# EAGLE design board rev 1 (EAGLE 9.0.1)
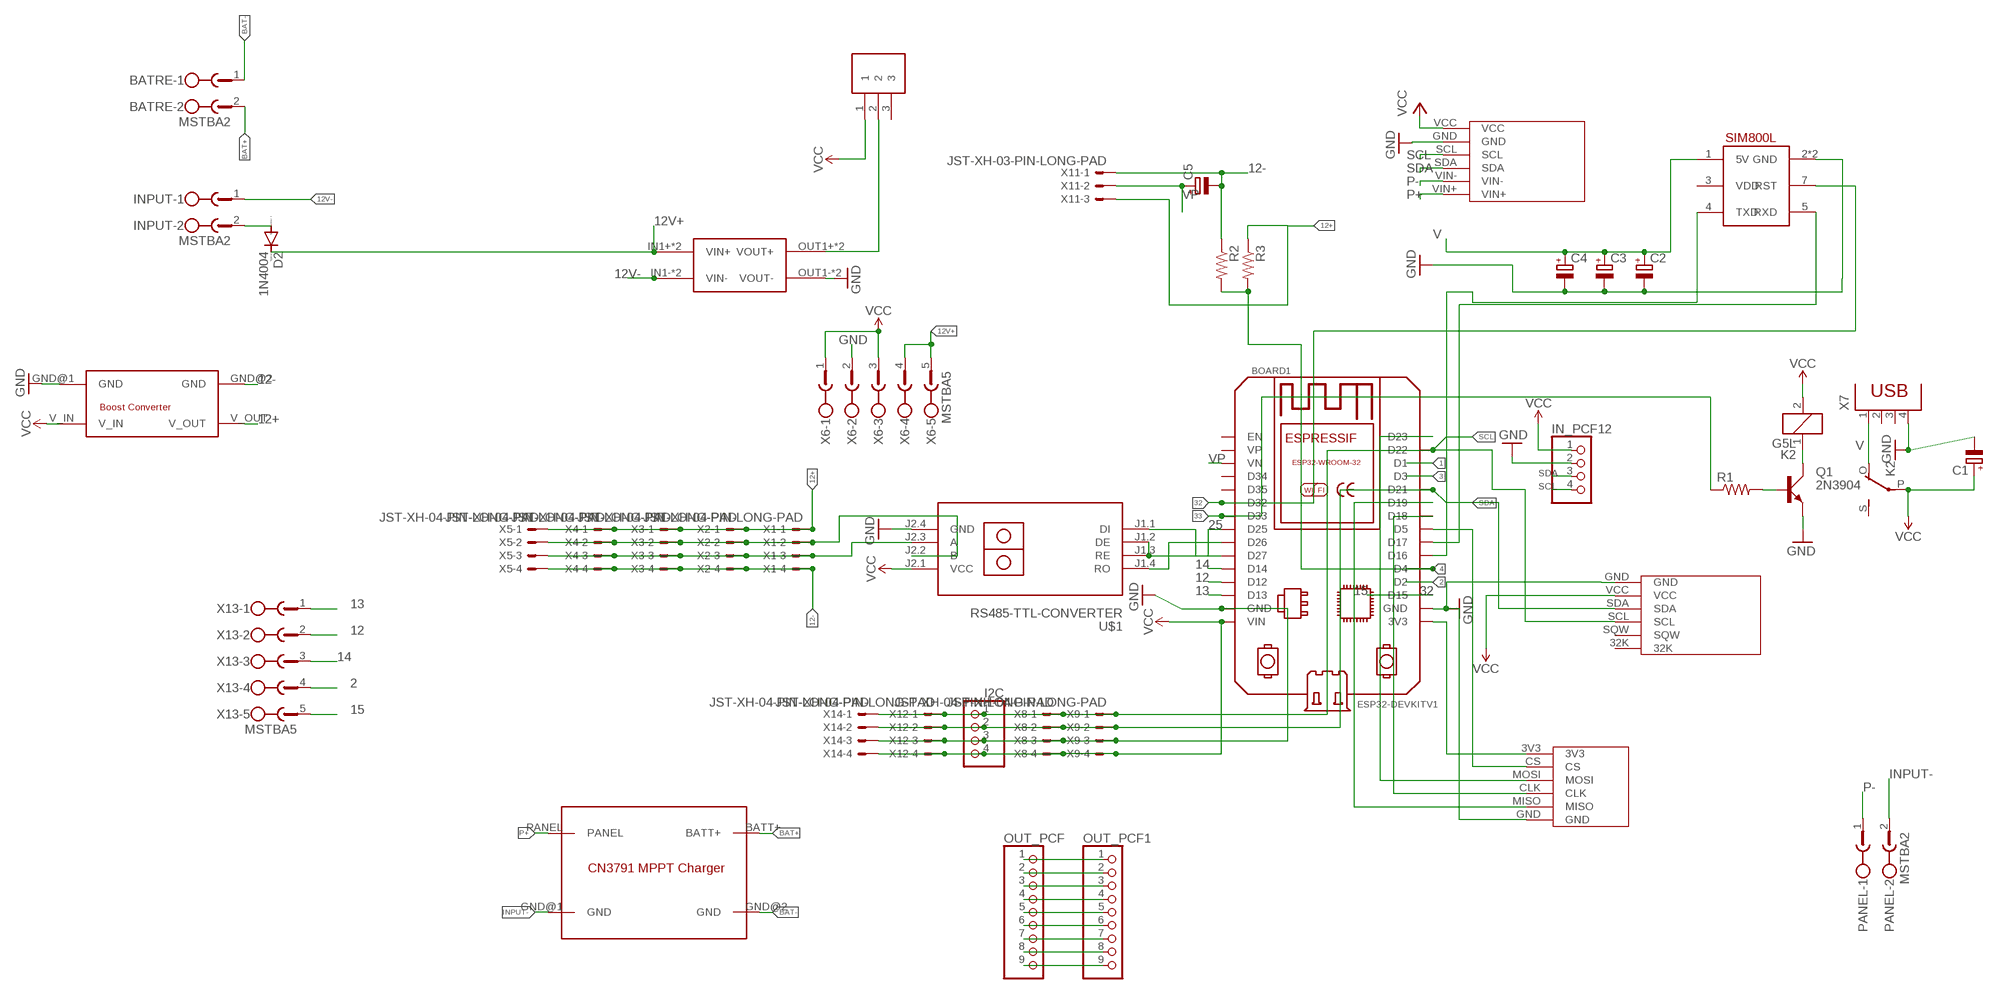
[diagram p0: schematic, sheet 1]

## Parts
BATRE  MSTBA2  [MSTBA2]
BOARD1  ESP32DEVKITV1  [ESP32-DEVKITV1]
C1  CPOL-EUE2.5-7  [E2,5-7]
C2  CPOL-EUE2.5-7  [E2,5-7]
C3  CPOL-EUE2.5-7  [E2,5-7]
C4  CPOL-EUE2.5-7  [E2,5-7]
C5  CPOL-EUE2.5-7  [E2,5-7]
D2  1N4004  [DO41-10]
I2C  PINHD-1X4  [1X04]
IN_PCF12  PINHD-1X4  [1X04]
INPUT  MSTBA2  [MSTBA2]
K2  G5L  [G5LE]
OUT_PCF  PINHD-1X9  [1X09]
OUT_PCF1  PINHD-1X9  [1X09]
PANEL  MSTBA2  [MSTBA2]
Q1  2N3904  [TO92D]
R1  R-US_0204/7  [0204/7]
R2  R-US_0204/7  [0204/7]
R3  R-US_0204/7  [0204/7]
SW1  SS12D10  [SS12D10]
U$1  RS485-TTL-CONVERTER  [RS485-TTL-CONVERTER]
U$2  CN3791_MTTP_LIPO_SOLAR_CHARGER  [CN3791_MPPT_LIPO_SOLAR_CHARGER]
U$3  MP1584  [DC-BRICK]
U$4  SIM800L  [SIP]
U$5  ICSA004A_BOOST_MODULE  [ICSA004A_BOOST_MODULE]
U$6  DS3231  [DS3231]
U$7  MICROSD3V3  [MICROSD3V3]
U$8  INA219  [INA219]
X1  JST-XH-04-PIN-LONG-PAD  [JST-XH-04-PACKAGE-LONG-PAD]
X2  JST-XH-04-PIN-LONG-PAD  [JST-XH-04-PACKAGE-LONG-PAD]
X3  JST-XH-04-PIN-LONG-PAD  [JST-XH-04-PACKAGE-LONG-PAD]
X4  JST-XH-04-PIN-LONG-PAD  [JST-XH-04-PACKAGE-LONG-PAD]
X5  JST-XH-04-PIN-LONG-PAD  [JST-XH-04-PACKAGE-LONG-PAD]
X6  MSTBA5  [MSTBA5]
X7  PN87520  [PN87520]
X8  JST-XH-04-PIN-LONG-PAD  [JST-XH-04-PACKAGE-LONG-PAD]
X9  JST-XH-04-PIN-LONG-PAD  [JST-XH-04-PACKAGE-LONG-PAD]
X11  JST-XH-03-PIN-LONG-PAD  [JST-XH-03-PACKAGE-LONG-PAD]
X12  JST-XH-04-PIN-LONG-PAD  [JST-XH-04-PACKAGE-LONG-PAD]
X13  MSTBA5  [MSTBA5]
X14  JST-XH-04-PIN-LONG-PAD  [JST-XH-04-PACKAGE-LONG-PAD]

## Nets
1: BOARD1.D1
2: BOARD1.D2 X13.4
3: BOARD1.D3
4: BOARD1.D4 R2.2 R3.2
12: BOARD1.D12 X13.2
12+: R3.1 U$5.V_OUT X1.1 X2.1 X3.1 X4.1 X5.1 X11.3
12-: C5.- R2.1 U$5.GND@2(GND) X1.4 X2.4 X3.4 X4.4 X5.4 X11.1
12V+: D2.C U$3.IN1+(VIN+) U$3.IN2+(VIN+) X6.4 X6.5
12V-: INPUT.1 U$3.IN1-(VIN-) U$3.IN2-(VIN-)
13: BOARD1.D13 X13.1
14: BOARD1.D14 X13.3
15: BOARD1.D15 X13.5
18: BOARD1.D18 U$7.CLK
19: BOARD1.D19 U$7.MISO
25: BOARD1.D25 U$1.J1.2(DE) U$1.J1.3(RE)
32: BOARD1.D32 U$4.7(RST)
33: BOARD1.D33 R1.1
BAT+: BATRE.2 U$2.BATT+
BAT-: BATRE.1 U$2.GND@2(GND)
GND: BOARD1.GND BOARD1.GND@1(GND) C1.- C2.- C3.- C4.- I2C.3 IN_PCF12.2 Q1.E U$1.J2.4(GND) U$3.OUT1-(VOUT-) U$3.OUT2-(VOUT-) U$4.2(GND) U$4.6(GND) U$5.GND@1(GND) U$6.GND U$7.GND U$8.GND X6.2 X7.4 X8.3 X9.3 X12.3 X14.3
INPUT-: PANEL.2 U$2.GND@1(GND)
N$1: BOARD1.D27 U$1.J1.1(DI)
N$2: BOARD1.D26 U$1.J1.4(RO)
N$3: OUT_PCF1.1 OUT_PCF.1
N$4: OUT_PCF1.2 OUT_PCF.2
N$5: SW1.2 U$3.OUT1+(VOUT+) U$3.OUT2+(VOUT+)
N$6: U$1.J2.2(B) X1.2 X2.2 X3.2 X4.2 X5.2
N$7: U$1.J2.3(A) X1.3 X2.3 X3.3 X4.3 X5.3
N$8: BOARD1.3V3 U$7.3V3
N$9: BOARD1.D5 U$7.CS
N$10: BOARD1.D23 U$7.MOSI
N$11: D2.A INPUT.2
N$12: OUT_PCF1.3 OUT_PCF.3
N$13: BOARD1.D16 U$4.4(TXD)
N$14: BOARD1.D17 U$4.5(RXD)
N$15: K2.1 Q1.C
N$16: OUT_PCF1.4 OUT_PCF.4
N$17: Q1.B R1.2
N$18: OUT_PCF1.5 OUT_PCF.5
N$20: OUT_PCF1.6 OUT_PCF.6
N$21: OUT_PCF1.7 OUT_PCF.7
N$22: OUT_PCF1.8 OUT_PCF.8
N$23: OUT_PCF1.9 OUT_PCF.9
P+: U$2.PANEL U$8.VIN+
P-: PANEL.1 U$8.VIN-
SCL: BOARD1.D22 I2C.1 IN_PCF12.4 U$6.SCL U$8.SCL X8.1 X9.1 X12.1 X14.1
SDA: BOARD1.D21 I2C.2 IN_PCF12.3 U$6.SDA U$8.SDA X8.2 X9.2 X12.2 X14.2
V: C2.+ C3.+ C4.+ K2.O(2:O) U$4.1(5V) X7.1
VCC: BOARD1.VIN C1.+ I2C.4 IN_PCF12.1 K2.2 K2.P(2:P) SW1.1 U$1.J2.1(VCC) U$5.V_IN U$6.VCC U$8.VCC X6.1 X6.3 X8.4 X9.4 X12.4 X14.4
VP: BOARD1.VN C5.+ X11.2
Unconnected: BOARD1.D34 BOARD1.D35 BOARD1.EN BOARD1.VP K2.S(2:S) SW1.3 U$4.3(VDD) U$6.32K U$6.SQW X7.2 X7.3

## Library data of the parts
BATRE INPUT PANEL = con-phoenix-508:MSTBA2: PHOENIX; MF: FARNELL; MPN: 1757242; OC_FARNELL: 3705171; OC_NEWARK: 71C4161
BOARD1 = ESP32-DEVKITV1:ESP32DEVKITV1: https://github.com/shridattdudhat
C1-C5 = FansElectronics-RCL:CPOL-EU: POLARIZED CAPACITOR, European symbol
D2 = diode:1N4004: DIODE general purpose rectifier, 1 A
I2C = FansElectronics-Header:PINHD-1X4: PIN HEADER
IN_PCF12 = pinhead:PINHD-1X4: PIN HEADER
K2 = relay:G5L: RELAY 1 x switch, 10 A/120 V AC, 8 A/30 V ADC, Omron; OC_FARNELL: unknown; OC_NEWARK: unknown
OUT_PCF OUT_PCF1 = FansElectronics-Header:PINHD-1X9: PIN HEADER
Q1 = transistor-small-signal:2N3904: NPN TRANSISTOR
R1-R3 = adafruit:R-US_: RESISTOR, American symbol
SW1 = ss12d10:SS12D10
U$1 = diy:RS485-TTL-CONVERTER: RS485 to TTL converter based on MAX485 chip
U$2 = mt3608:CN3791_MTTP_LIPO_SOLAR_CHARGER: CN3791 MPPT Solar charger module For single cell LIPO battery. Max 25V input.
U$3 = MP1584-dc-brick:MP1584: MP1584-dc-brick-pcb Step down Input: 4.5V - 28V Ouput 0.8V - 25V max. 3A Cheap on ebay
U$4 = SIM800L:SIM800L: SIM800L Blue EVB Board with Level Translation and diode dropper.
U$5 = mt3608:ICSA004A_BOOST_MODULE: ISCA004A Boost converter module Vin: 2-24 V Vout: 28 V Iout: 2 A (Realistic: 500mA without heatsink) Efficiency: 80% Low quiecent current (about 0.5mA) Not isolated (common ground) Dimensions: 36 mm * 17 mm * (8)14 mm http://www.icstation.com/icstation-mt3608-step-booster-power-apply-module-p-3448.html
U$6 = DS3231:DS3231
U$7 = microsd3v3:MICROSD3V3
U$8 = INA219:INA219
X1-X5 X8 X9 X12 X14 = Rembrandt Electronics - JST XH Connectors v1-0:JST-XH-04-PIN: JST XH Connector 2 Pin Wire to board connector. Pitch: 2,54 mm, (0.100") Number of pins: 4 Created by Rembrandt Electronics www.rembrandtelectronics.com
X6 X13 = con-phoenix-508:MSTBA5: PHOENIX; MPN: 1757271; OC_FARNELL: 3705201; OC_NEWARK: 71C4164
X7 = con-berg:PN87520: BERG USB connector; OC_FARNELL: unknown; OC_NEWARK: unknown
X11 = Rembrandt Electronics - JST XH Connectors v1-0:JST-XH-03-PIN: JST XH Connector 2 Pin Wire to board connector. Pitch: 2,54 mm, (0.100") Number of pins: 3 Created by Rembrandt Electronics www.rembrandtelectronics.com

## Board
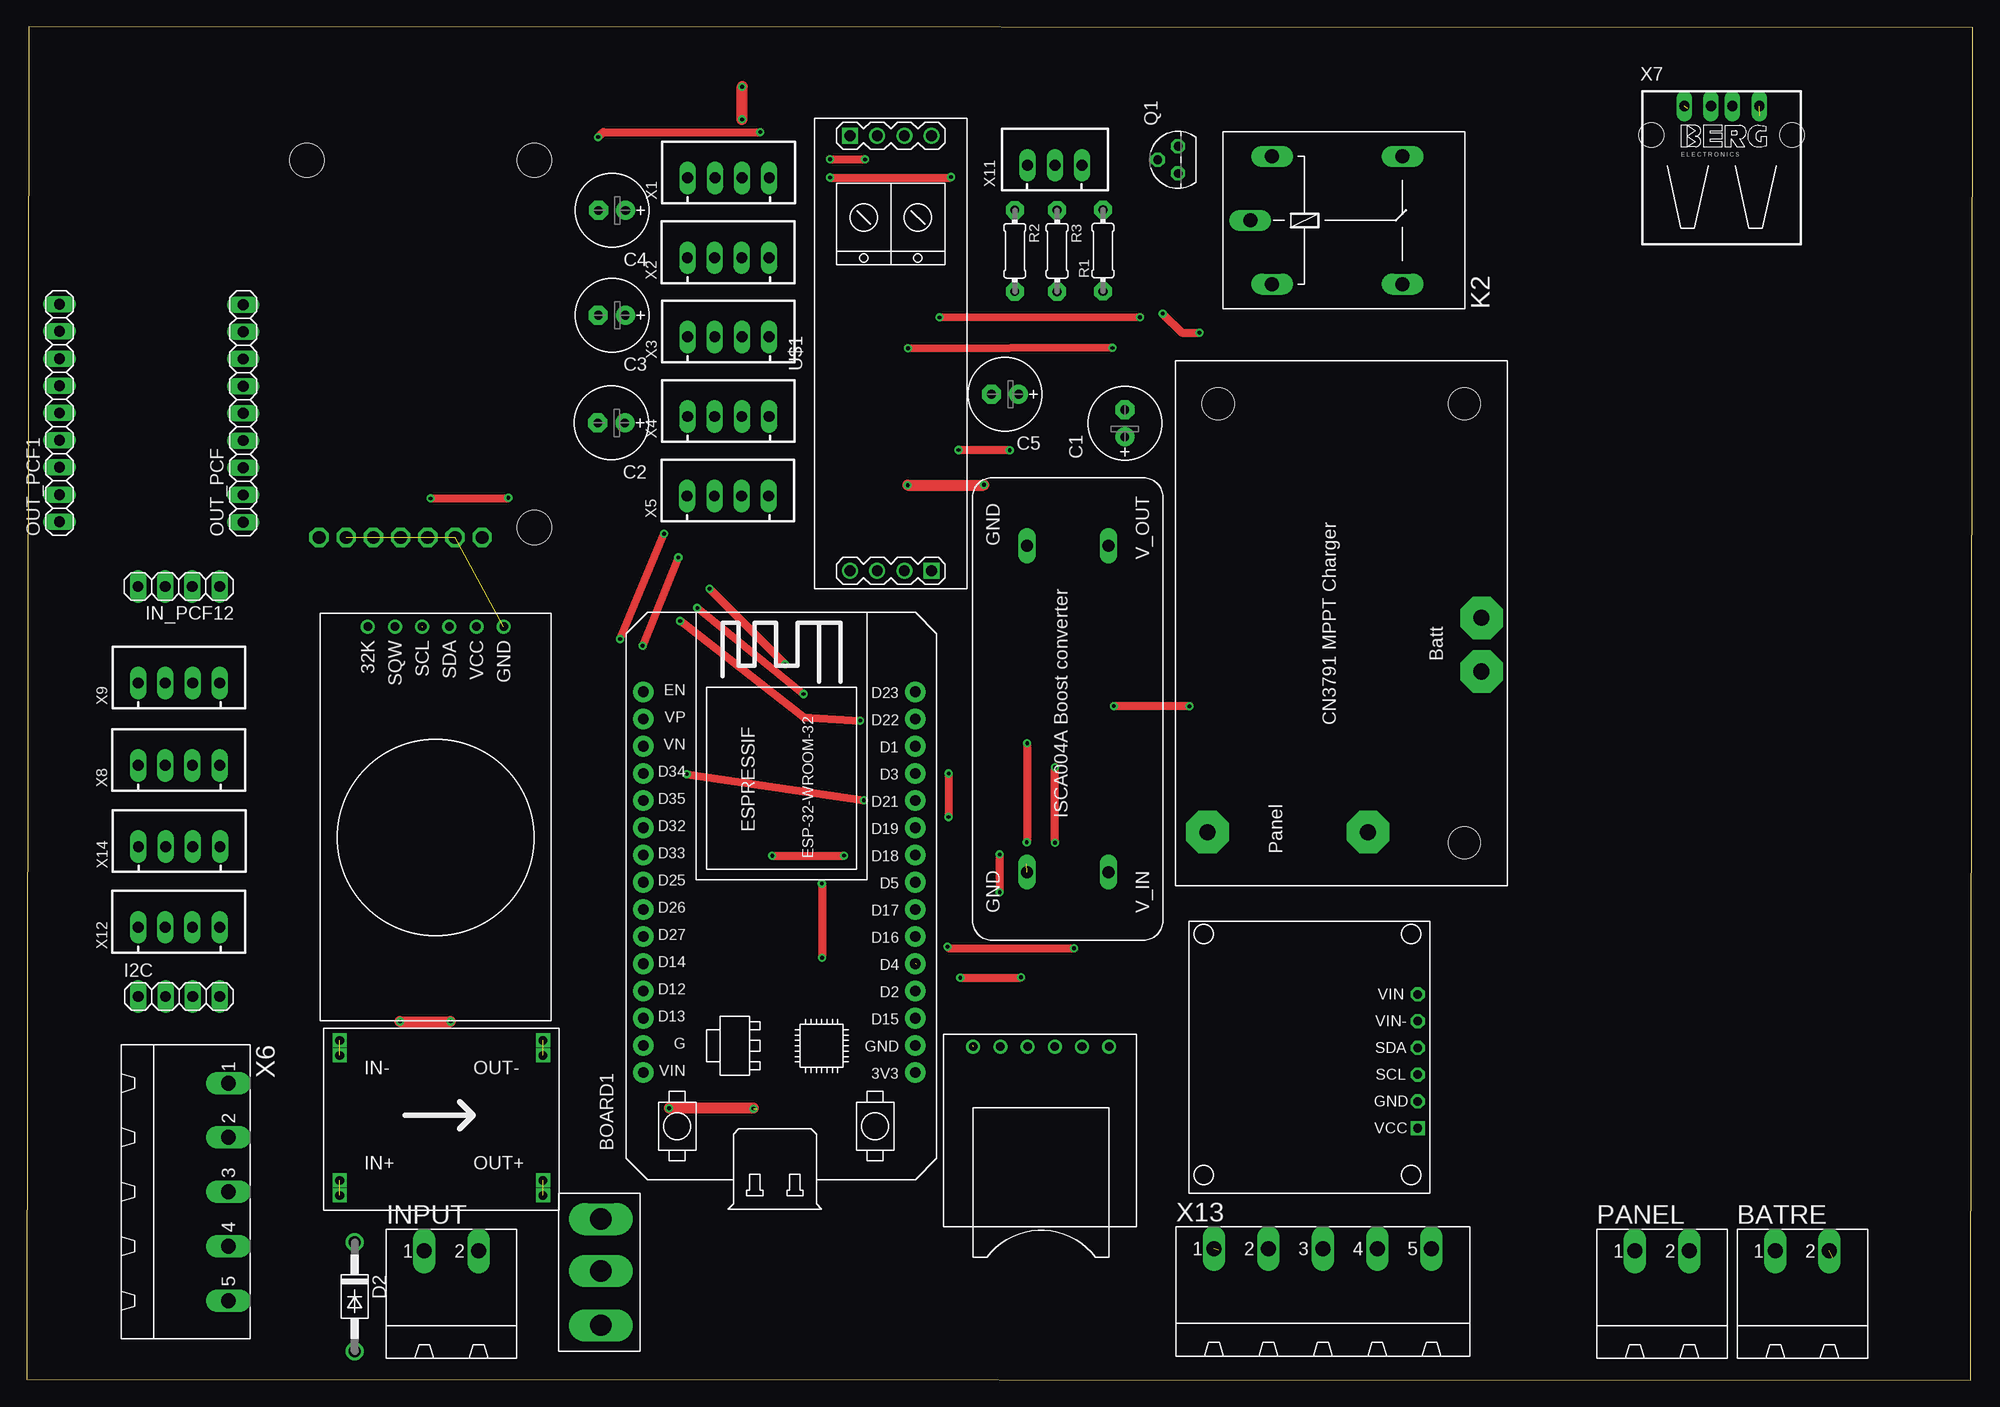
[diagram p1: board, top side]
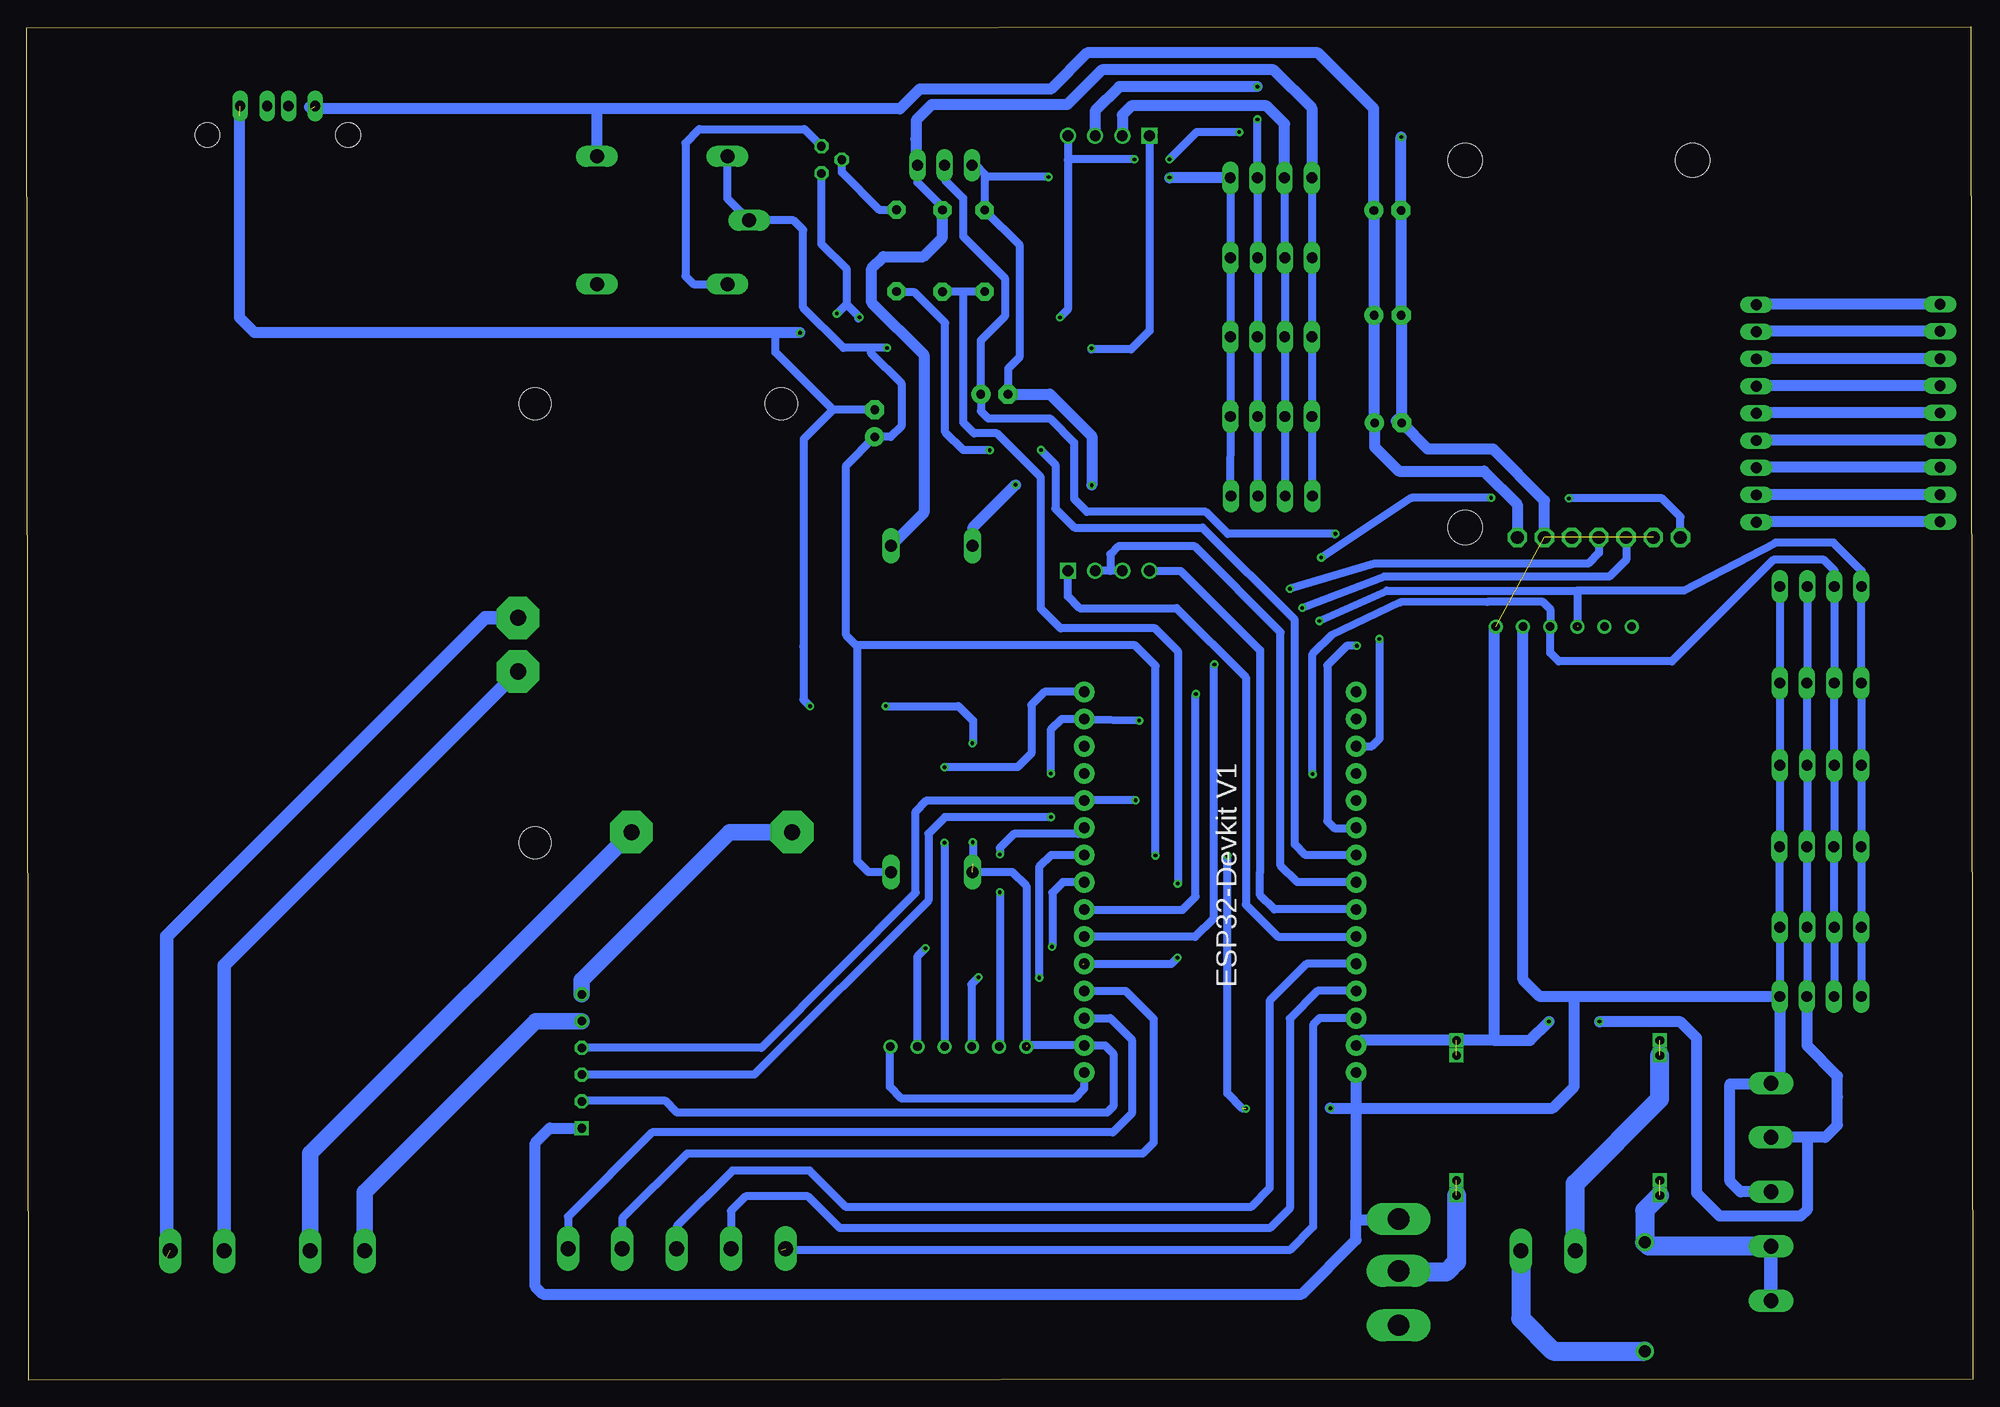
[diagram p2: board, bottom side, seen from below]

Size 181.8 x 126.41 mm. Coordinates in mm from the lower left corner, seen from the top.
Outline: 0,0.09 181.61,0 181.8,126.32 0.18,126.41 0,0.09
Copper layers (1*16): Top 0.035mm / dielectric 1.5mm / Bottom 0.035mm
Design rules "default": minimum track width 6mil, minimum drill 0.35mm, track to track 6mil, track to pad 6mil, pad to pad 6mil, via to via 6mil, smd to smd 6mil, copper to edge 40mil, drill to drill 6mil, minimum pad ring 10mil, minimum via ring 8mil, stop-mask expansion 4mil, vias tented up to drill 0mil, thermal gap 10mil

### Footprints (pad centres in the part's own frame; a part is rotated, then mirrored left to right if it is on the bottom)
MSTBA2 = drill 1.397 long: 1 -2.54,5.08; 2 2.54,5.08
ESP32-DEVKITV1 = drill 1 pad 1.93: 3V3 0,0; D1 30.48,0; D2 7.62,0; D3 27.94,0; D4 10.16,0; D5 17.78,0; D12 7.62,25.4; D13 5.08,25.4; D14 10.16,25.4; D15 5.08,0; D16 12.7,0; D17 15.24,0; D18 20.32,0; D19 22.86,0; D21 25.4,0; D22 33.02,0; D23 35.56,0; D25 17.78,25.4; D26 15.24,25.4; D27 12.7,25.4; D32 22.86,25.4; D33 20.32,25.4; D34 27.94,25.4; D35 25.4,25.4; EN 35.56,25.4; GND 2.54,25.4; GND@1 2.54,0; VIN 0,25.4; VN 30.48,25.4; VP 33.02,25.4
E2,5-7 = drill 0.813 pad 1.778: + -1.27,0 | drill 0.813 pad 1.778 octagon: - 1.27,0
DO41-10 = drill 1.118: A 5.08,0; C -5.08,0
1X04 = drill 1.016 long: 1 -3.81,0; 2 -1.27,0; 3 1.27,0; 4 3.81,0
G5LE = drill 1.321 long: 1 -7.493,-5.969; 2 -7.493,5.969; O 4.699,5.969; P -9.525,0; S 4.699,-5.969
1X09 = drill 1.016 long: 1 -10.16,0; 2 -7.62,0; 3 -5.08,0; 4 -2.54,0; 5 0,0; 6 2.54,0; 7 5.08,0; 8 7.62,0; 9 10.16,0
TO92D = drill 0.813 octagon: B 0,1.905; C 1.27,0; E -1.27,0
0204/7 = drill 0.813 pad 1.676 octagon: 1 -3.81,0; 2 3.81,0
SS12D10 = drill 2 pad 3 long: 1 0.127,4.699; 2 0.127,-0.127; 3 0.127,-5.207
RS485-TTL-CONVERTER = drill 1 square: J1.1 -20.32,-3.81; J2.1 20.32,3.81 | drill 1: J1.2 -20.32,-1.27; J1.3 -20.32,1.27; J1.4 -20.32,3.81; J2.2 20.32,1.27; J2.3 20.32,-1.27; J2.4 20.32,-3.81
CN3791_MPPT_LIPO_SOLAR_CHARGER = drill 1.5 pad 4 octagon: BATT+ 25,2.4; GND@1 5,13; GND@2 20,2.4; PANEL 5,28 | hole 3: 4,4; 45,4; 45,27
DC-BRICK = drill 0.8 square: IN1+ 1.5,1.4; IN1- 1.5,14.47; IN2+ 1.5,2.8; IN2- 1.5,15.87; OUT1+ 20.5,1.4; OUT1- 20.5,14.47; OUT2+ 20.5,2.8; OUT2- 20.5,15.87
SIP = drill 1.2 octagon: 1 38.1,19.24; 2 38.1,16.7; 3 38.1,14.16; 4 38.1,11.62; 5 38.1,9.08; 6 38.1,6.54; 7 38.1,4 | hole 3.2: 2.87,24.13; 2.87,2.87; 37.16,24.13
ICSA004A_BOOST_MODULE = drill 1.1 long: GND@1 0,7.62; GND@2 30.48,7.62; V_IN 0,0; V_OUT 30.48,0
DS3231 = drill 0.8: 32K 1.27,-17.145; GND 1.27,-4.445; SCL 1.27,-12.065; SDA 1.27,-9.525; SQW 1.27,-14.605; VCC 1.27,-6.985
MICROSD3V3 = drill 0.8: 3V3 1.27,-2.54; CLK 1.27,-10.16; CS 1.27,-5.08; GND 1.27,-15.24; MISO 1.27,-12.7; MOSI 1.27,-7.62
INA219 = drill 0.8 octagon: GND 1.25,-8.75; SCL 1.25,-11.25; SDA 1.25,-13.75; VIN+ 1.25,-18.75; VIN- 1.25,-16.25 | drill 0.8 square: VCC 1.25,-6.25
JST-XH-04-PACKAGE-LONG-PAD = drill 1.016 long: 1 -3.81,0; 2 -1.27,0; 3 1.27,0; 4 3.81,0
MSTBA5 = drill 1.397 long: 1 -10.16,5.08; 2 -5.08,5.08; 3 0,5.08; 4 5.08,5.08; 5 10.16,5.08
PN87520 = drill 0.95 long: 1 -3.5,2.71; 2 -1,2.71; 3 1,2.71; 4 3.5,2.71 | hole 2.3: -6.57,0; 6.57,0
JST-XH-03-PACKAGE-LONG-PAD = drill 1.016 long: 1 -2.54,0; 2 0,0; 3 2.54,0

### Placement (x,y rotation side)
BATRE  165.88,6.99 0 top
BOARD1  83.01,28.73 90 top
C1  102.58,89.37 90 top
C2  54.62,89.41 180 top
C3  54.66,99.47 180 top
C4  54.67,109.26 180 top
C5  91.39,92.09 180 top
D2  30.63,7.8 270 top
I2C  14.23,35.84 0 top
IN_PCF12  14.2,74.13 180 top
INPUT  39.68,6.99 0 top
K2  123.83,108.33 0 top
OUT_PCF  20.22,90.3 90 top
OUT_PCF1  3.06,90.34 90 top
PANEL  152.78,7 0 top
Q1  107.56,113.98 90 top
R1  100.54,105.51 90 top
R2  92.3,105.48 270 top
R3  96.25,105.48 270 top
SW1  53.49,10.34 0 top
U$1  80.72,95.91 90 top
U$2  138.31,46.19 90 top
U$3  27.73,15.86 0 top
U$4  23.3,116.81 270 top
U$5  101.06,47.46 90 top
U$6  49,71.65 270 top
U$7  103.66,32.42 270 top
U$8  131.19,17.28 180 top
X1  65.56,112.29 0 top
X2  65.53,104.83 0 top
X3  65.55,97.44 0 top
X4  65.53,90 0 top
X5  65.5,82.58 0 top
X6  13.76,17.59 270 top
X7  158.35,116.29 0 top
X8  14.2,57.43 0 top
X9  14.22,65.11 0 top
X11  96.04,113.48 0 top
X12  14.21,42.3 0 top
X13  121.08,7.21 0 top
X14  14.24,49.84 0 top

### Tracks (layer width: path | path; a pad name or v marks a point on that pad's centre or on a via)
2
  Bottom 0.762: BOARD1.D2 79.14,36.35 76.53,33.75 76.53,22.19 77.56,21.17 120.1,21.17 126.16,15.11 X13.4
4  (via drill 0.35)  (1 unrouted)
  Top 0.762: v74.27,46.39 74.29,46.37 v74.29,39.47
  Bottom 0.762: R2.2 94.3,101.67 | 94.3,101.67 R3.2 | v74.27,46.39 74.25,46.4 74.25,68.09 76.39,70.23 85.2,70.23 87.05,72.07 87.05,84.32 91.17,88.44 93.29,88.44 94.3,89.45 94.3,101.67 | v74.29,39.47 74.9,38.85 83.14,38.85
12
  Bottom 0.762: BOARD1.D12 61.22,36.35 63.8,33.77 63.8,16.05 65.66,14.19 105.83,14.19 108.82,17.18 114.63,17.18 116,15.81 X13.2
12+
  Bottom 0.762: X1.1 61.75,104.86 X2.1 61.72,97.47 X3.1 61.74,90.02 X4.1 61.72,82.61 X5.1 | X11.3 98.58,111.87 96.25,109.55 R3.1
  Bottom 1.016: 98.71,115.92 98.71,117.67 97.25,119.13 84.62,119.13 81.35,122.39 65.31,122.39 61.75,118.83 X1.1 | 98.71,115.92 98.72,115.91 | 98.71,115.92 98.71,113.61 X11.3 | 96.25,109.55 96.25,106.73 98.04,104.94 101.78,104.94 102.87,103.84 102.87,100.66 97.99,95.78 97.99,81 U$5.V_OUT
12-  (via drill 0.35)
  Top 0.762: v75.04,112.33 86.29,112.33 v86.34,112.38
  Top 1.016: v82.29,83.6 89.39,83.6 v89.42,83.63
  Bottom 0.762: X1.4 69.37,104.86 X2.4 69.34,97.47 X3.4 69.36,90.02 X4.4 69.38,82.61 X5.4 | X11.1 93.13,113.48 92.3,112.65 | 92.3,112.65 R2.1 89.07,106.06 89.07,95.54 90.12,94.48 C5.- | 75,112.3 v75.04,112.33 | v86.34,112.38 92.03,112.38 92.3,112.65
  Bottom 1.016: X1.4 75,112.3 | C5.- 86.21,92.09 82.29,88.18 v82.29,83.6 | v89.42,83.63 93.44,79.61 U$5.GND@2
12V+  (1 unrouted)
  Bottom 1.27: X6.4 X6.5
  Bottom 1.778: U$3.IN1+ 30.63,15.87 D2.C 30.26,12.51 X6.4
12V-  (1 unrouted)
  Bottom 1.778: INPUT.1 37.14,18.37 29.23,26.28 U$3.IN1-
13  (1 unrouted)
  Bottom 0.762: BOARD1.D13 61.01,33.81 61.63,33.2 61.63,14.32 63.8,12.15 111.34,12.15 111.46,12.02
14
  Bottom 0.762: BOARD1.D14 62.23,38.89 65.68,35.44 65.68,17.95 67.45,16.18 105.26,16.18 108.65,19.57 115.88,19.57 121.08,14.36 X13.3
15
  Bottom 0.762: BOARD1.D15 80.57,33.81 78.56,31.81 78.56,24.93 80.34,23.15 123.36,23.15 131.24,15.28 X13.5
18  (via drill 0.35)
  Top 0.762: v87.21,37.6 92.85,37.6 v92.88,37.63
  Bottom 0.762: BOARD1.D18 86.11,49.05 87.23,47.93 87.23,37.62 v87.21,37.6 | v92.88,37.63 93.54,36.97 93.54,31.19 U$7.CLK
19  (via drill 0.35)
  Top 0.762: v90.89,49.11 v90.89,45.58
  Bottom 0.762: BOARD1.D19 83.58,51.02 89.58,51.02 90.89,49.72 v90.89,49.11 | v90.89,45.58 90.89,31.22 U$7.MISO
25
  Bottom 0.762: BOARD1.D25 63.11,46.51 64.66,48.06 64.66,69.85 72.68,77.87 79.85,77.87 80.58,77.15 80.58,75.59 | 79.47,75.61 U$1.J1.3 80.58,75.59 | 80.58,75.59 U$1.J1.2
32  (via drill 0.35)
  Top 0.762: v60.87,76.84 57.52,68.61 v57.54,68.59 | v37.74,82.36 44.95,82.36 v45,82.41
  Bottom 0.762: v57.54,68.59 58.48,68.59 60.3,66.77 60.3,52.21 59.65,51.56 57.64,51.56 BOARD1.D32 | U$4.7 27.3,80.63 29.04,82.37 v37.73,82.37 v37.74,82.36 | v45,82.41 52.44,82.41 v60.87,76.84
33  (via drill 0.35)
  Top 0.762: v91.83,86.85 87.08,86.85 v87.05,86.88
  Bottom 0.762: BOARD1.D33 62.32,49.05 63.33,50.05 63.33,71.01 71.94,79.63 71.96,79.62 83.91,79.62 85.7,81.41 85.7,85.53 v87.05,86.88 | R1.1 100.54,101.6 98.84,101.6 95.99,98.75 95.99,88.56 94.32,86.88 91.86,86.88 v91.83,86.85
BAT+  (1 unrouted)
  Bottom 1.27: U$2.BATT+ 138.98,71.2 168.71,41.46 168.71,11.42
BAT-
  Bottom 1.27: U$2.GND@2 163.34,38.77 BATRE.1
GND  (via drill 0.35)  (6 unrouted)
  Top 0.762: v85.28,99.27 103.97,99.32 v104,99.28 | v106.12,99.62 107.91,97.83 v109.56,97.83 | v108.63,62.96 v101.56,62.96 v101.55,62.97 | v93.46,59.48 93.46,50.28 v93.42,50.24 | v53.38,116.11 53.85,116.57 v68.52,116.57 | v75.04,114.04 78.3,114.04 v78.32,114.02
  Top 1.016: v34.88,33.5 v39.59,33.5
  Bottom 0.762: I2C.3 15.48,35.86 X12.3 15.51,42.34 X14.3 15.48,49.87 X8.3 15.49,57.44 X9.3 | 15.49,66.35 X9.3 | 88.35,31.27 BOARD1.GND@1 81.06,31.27 80.29,30.51 80.29,25.58 80.87,25 121.02,25 122.11,26.09 129.89,26.09 U$8.GND | IN_PCF12.2 15.47,65.13 X9.3 | U$1.J2.4 84.53,113.98 | 84.53,113.98 84.53,100.01 v85.28,99.27 | v104,99.28 104.1,99.18 | 103.97,99.25 v104,99.28 | v104,99.28 105.18,100.46 105.18,100.56 | 105.18,100.56 105.18,103.75 107.56,106.12 Q1.E | 105.18,100.56 v106.12,99.62 | C1.- 106.47,90.64 | 111.85,97.83 111.85,96.01 106.47,90.64 | 106.47,90.64 109.21,87.9 109.21,68.55 109.24,68.52 109.24,63.57 v108.63,62.96 | U$5.GND@1 89.71,47.46 88.42,46.16 U$7.GND | v101.55,62.97 94.75,62.97 93.39,61.6 93.39,59.56 v93.46,59.48 | v93.42,50.24 93.42,48.29 93.38,48.25 | v78.32,114.02 84.49,114.02 84.53,113.98 | v68.52,116.57 72.51,116.57 v75.04,114.04
  Bottom 1.016: 15.31,22.67 X6.2 | 15.31,22.67 13.78,22.67 12.63,23.82 12.63,26.44 | 15.31,22.67 15.43,22.55 15.43,15.99 16.1,15.32 23.63,15.32 25.78,17.47 25.78,31.95 27.31,33.48 34.85,33.48 v34.88,33.5 | 15.51,74.17 IN_PCF12.2 | v109.56,97.83 111.85,97.83 160.52,97.83 161.93,99.24 161.93,118.12 | U$3.OUT1- 48.32,30.25 | 44.68,31.74 U$3.OUT2- 57.15,31.74 BOARD1.GND | 12.61,26.46 12.63,26.44 | U$4.2 40,82.16 44.8,86.96 50.9,86.96 C2.- 53.67,89.41 53.85,89.59 53.39,90.05 C3.- 53.4,99.49 C4.- 53.4,116.08 v53.38,116.11 | 15.48,35.86 15.48,31.24 12.63,28.39 12.63,26.44 | 44.55,31.86 44.68,31.74 | v39.59,33.5 41.36,31.74 44.68,31.74 | 44.68,31.74 44.68,70.26 U$6.GND
INPUT-
  Bottom 1.524: U$2.GND@1 155.32,21.19 PANEL.2
N$1
  Bottom 0.762: U$1.J1.1 84.53,73.22 83.43,72.12 74.38,72.12 67.9,65.64 67.9,44.41 64.92,41.43 BOARD1.D27
N$2
  Bottom 0.762: U$1.J1.4 73.99,75.59 66.59,68.19 66.59,48.06 66.59,47.48 66.59,45.3 65.26,43.97 BOARD1.D26
N$3
  Bottom 1.016: OUT_PCF1.1 20.19,80.18 OUT_PCF.1
N$4
  Bottom 1.016: OUT_PCF1.2 20.19,82.72 OUT_PCF.2
N$5  (1 unrouted)
  Bottom 1.778: U$3.OUT1+ 48.23,11.06 49.19,10.11 53.51,10.11 SW1.2
N$6
  Bottom 0.762: X1.2 64.29,104.86 X2.2 64.26,97.47 X3.2 64.28,90.02 X4.2 64.26,82.61 X5.2
  Bottom 1.016: X1.2 64.29,117.35 65.96,119.03 78.59,119.03 79.45,118.17 U$1.J2.2
N$7  (via drill 0.35)
  Top 1.016: v66.82,117.76 v66.83,120.82
  Bottom 0.762: X5.3 66.8,82.61 X4.3 66.82,90.02 X3.3 66.8,97.47 X2.3 66.83,104.86 X1.3 v66.82,117.76
  Bottom 1.016: v66.83,120.82 79.73,120.82 81.99,118.55 U$1.J2.3
N$8
  Bottom 0.762: BOARD1.3V3 83.01,27.23 83.94,26.31 100.07,26.31 101.16,27.41 101.16,31.11 U$7.3V3
N$9  (via drill 0.35)
  Top 0.762: v86.01,40.49 86.17,40.34 v97.83,40.34
  Bottom 0.762: BOARD1.D5 85,46.51 85.97,45.54 85.97,40.53 v86.01,40.49 | v97.83,40.34 98.62,39.55 98.62,31.19 U$7.CS
N$10  (via drill 0.35)
  Top 0.762: v96.07,50.2 v96.07,57.26
  Bottom 0.762: 96.08,50.19 v96.07,50.2 96.07,31.18 U$7.MOSI | BOARD1.D23 86.72,64.29 87.94,63.07 87.94,58.55 89.23,57.26 v96.07,57.26
N$11
  Bottom 1.778: D2.A 39.21,2.72 42.22,5.74 INPUT.2
N$12
  Bottom 1.016: OUT_PCF1.3 20.19,85.26 OUT_PCF.3
N$13  (via drill 0.35)
  Top 0.762: v70.85,66.86 v63.79,73.92
  Bottom 0.762: BOARD1.D16 82.98,41.4 72.65,41.4 70.9,43.15 70.9,66.81 v70.85,66.86 | v63.79,73.92 63.78,73.92 | 63.78,73.92 63.77,73.93 | U$4.4 34.92,77.27 35.93,76.26 55.88,76.26 63.78,73.92
N$14  (via drill 0.35)
  Top 0.762: v72.56,64.09 v62.64,72.14
  Bottom 0.762: BOARD1.D17 82.95,43.91 73.86,43.91 72.61,45.16 72.61,64.04 v72.56,64.09 | U$4.5 32.38,76.62 33.96,75.05 55,75.05 v62.64,72.14
N$15
  Bottom 0.762: K2.1 119.51,102.36 120.27,103.12 120.27,115.54 118.97,116.84 109.14,116.84 Q1.C
N$16
  Bottom 1.016: OUT_PCF1.4 20.19,87.8 OUT_PCF.4
N$17
  Bottom 0.762: R1.2 100.57,109.28 102.13,109.28 105.65,112.81 Q1.B
N$18
  Bottom 1.016: OUT_PCF1.5 20.19,90.34 OUT_PCF.5
N$20
  Bottom 1.016: OUT_PCF1.6 20.19,92.88 OUT_PCF.6
N$21
  Bottom 1.016: OUT_PCF1.7 20.19,95.42 OUT_PCF.7
N$22
  Bottom 1.016: OUT_PCF1.8 20.19,97.96 OUT_PCF.8
N$23
  Bottom 1.016: OUT_PCF1.9 20.19,100.5 OUT_PCF.9
P+
  Bottom 1.524: U$2.PANEL 116.12,51.2 129.94,37.37 U$8.VIN+
P-
  Bottom 1.524: PANEL.1 150.24,17.56 134.27,33.54 U$8.VIN-
SCL  (via drill 0.35)  (1 unrouted)
  Top 0.762: v86.13,56.67 86.13,52.62 v86.11,52.6 | v61.04,70.91 72.57,61.92 v77.86,61.61
  Bottom 0.762: I2C.1 10.4,35.86 X12.1 10.43,42.34 X14.1 10.4,49.87 X8.1 10.41,57.44 X9.1 10.41,74.11 IN_PCF12.4 10.39,75.61 13.01,78.23 18.41,78.23 18.45,78.19 26.98,73.74 36.89,73.74 | v77.86,61.61 82.99,61.67 BOARD1.D22 85.13,61.75 86.15,60.73 86.15,56.69 v86.13,56.67 | v86.11,52.6 96.03,52.6 97.57,51.06 97.57,44.8 113.84,28.54 U$8.SCL | v61.04,70.91 54.74,73.74 36.89,73.74 | 36.89,70.42 36.89,73.74
SDA  (via drill 0.35)
  Top 0.762: v61.67,56.61 v78.21,54.16
  Bottom 0.762: 12.95,57.44 X8.2 | X8.2 12.94,49.87 X14.2 12.97,42.34 X12.2 12.94,35.86 I2C.2 | v78.21,54.16 83,54.15 | 83,54.15 BOARD1.D21 | 12.94,65.13 X9.2 | X8.2 12.94,65.13 | 12.94,65.13 12.93,65.13 IN_PCF12.3 12.93,75.64 13.9,76.62 18.62,76.62 28.1,67.14 38.67,67.14 39.47,67.94 U$6.SDA | 83,54.15 97.72,54.15 98.75,53.12 98.75,45.55 113,31.2 113.17,31.04 U$8.SDA | v61.67,56.61 61.67,67.84 59.91,69.59 53.49,72.66 45.35,72.69 40.14,72.69 39.47,72.03 U$6.SDA | U$6.SDA
V  (1 unrouted)
  Bottom 1.016: 128.37,118.75 100.22,118.75 98.39,120.58 86.13,120.58 82.73,123.97 61.16,123.97 55.94,118.75 C4.+ 55.94,99.49 C3.+ 55.89,99.43 C2.+ 55.89,87.17 53.62,84.91 45.65,84.91 42.54,81.8 U$4.1 | 128.37,118.75 155.2,118.75 155.37,118.92 | K2.O 128.53,118.59 128.37,118.75
VCC  (via drill 0.35)  (1 unrouted)
  Top 0.762: v69.64,48.98 76.33,48.98 v76.35,49 | v67.9,25.37 67.87,25.4 | v82.33,96.39 101.36,96.47 v101.42,96.41
  Top 1.016: 67.87,25.4 v60.01,25.4
  Bottom 0.762: I2C.4 18.02,35.86 X12.4 18.05,42.34 X14.4 18.02,49.87 X8.4 18.03,57.44 X9.4 18.06,65.15 18.01,65.2 IN_PCF12.1 | v69.64,48.98 v69.63,48.97 69.63,26.8 68.21,25.37 | v76.35,49 76.35,66.71 76.34,66.72 78.26,68.64 104.31,68.64 | U$1.J2.1 76.91,98 78.62,96.29 82.35,96.29 v82.33,96.39 | v101.42,96.41 102.95,96.41 | 102.95,96.41 105.5,96.41 109.27,100.18 109.27,107.43 110.17,108.33 K2.P 116.34,110.36 K2.2 | 102.95,96.41 102.95,95.98 100.1,93.13 100.1,89.1 101.1,88.1 C1.+ 105.25,85.42 105.25,69.58 104.31,68.64 | U$5.V_IN 103.17,47.46 104.2,48.49 104.2,68.53 104.31,68.64
  Bottom 1.016: X6.3 21.69,17.59 22.68,18.58 22.68,27.65 18.95,27.65 X6.1 18.04,28.56 I2C.4 | BOARD1.VIN 57.61,25.54 | 57.61,25.54 57.61,14.96 | 57.48,25.4 39.24,25.4 37.23,27.41 37.23,35.84 | 57.48,25.4 57.61,25.54 | v60.01,25.4 57.48,25.4 | 18.13,35.75 I2C.4 | I2C.4 37.23,35.84 | 37.23,35.84 40.43,35.84 42.01,37.42 U$6.VCC | 57.61,14.96 57.61,13.1 62.67,8.03 133.59,8.03 134.3,8.74 134.3,22.18 132.94,23.54 U$8.VCC | SW1.1 53.7,14.96 57.61,14.96
VP  (via drill 0.35)
  Top 0.762: v55.42,69.23 v59.53,79.05
  Bottom 0.762: X11.2 96.04,112.13 94.32,110.41 94.32,106.83 90.43,102.93 90.43,99.35 92.66,97.12 C5.+ 92.66,90.5 91.99,89.83 86.22,89.83 83.96,87.57 83.96,82.31 82.75,81.1 71.64,81.1 69.59,79.05 v59.53,79.05 59.6,78.98 | v55.42,69.23 55.42,59.93 56.18,59.17 57.57,59.17 BOARD1.VN